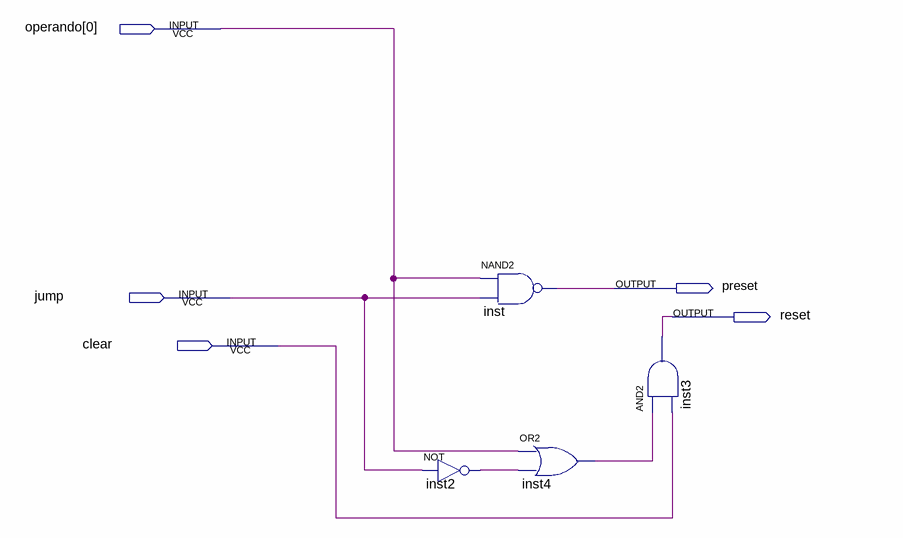
[diagram p0: schematic sheet]
// Quartus schematic jump.bdf as structural Verilog: 4 symbols, 5 pins
module jump (
  input  [0:0] operando,
  input  jump,
  input  clear,
  output preset,
  output reset
);

  wire inst2_out, inst4_out;

  not inst2 (inst2_out, jump);
  nand inst (preset, operando[0], jump);
  or inst4 (inst4_out, operando[0], inst2_out);
  and inst3 (reset, inst4_out, clear);
endmodule
